# EAGLE board teensy_speeduino_5.1 (EAGLE 9.5.0), part 1 of 2
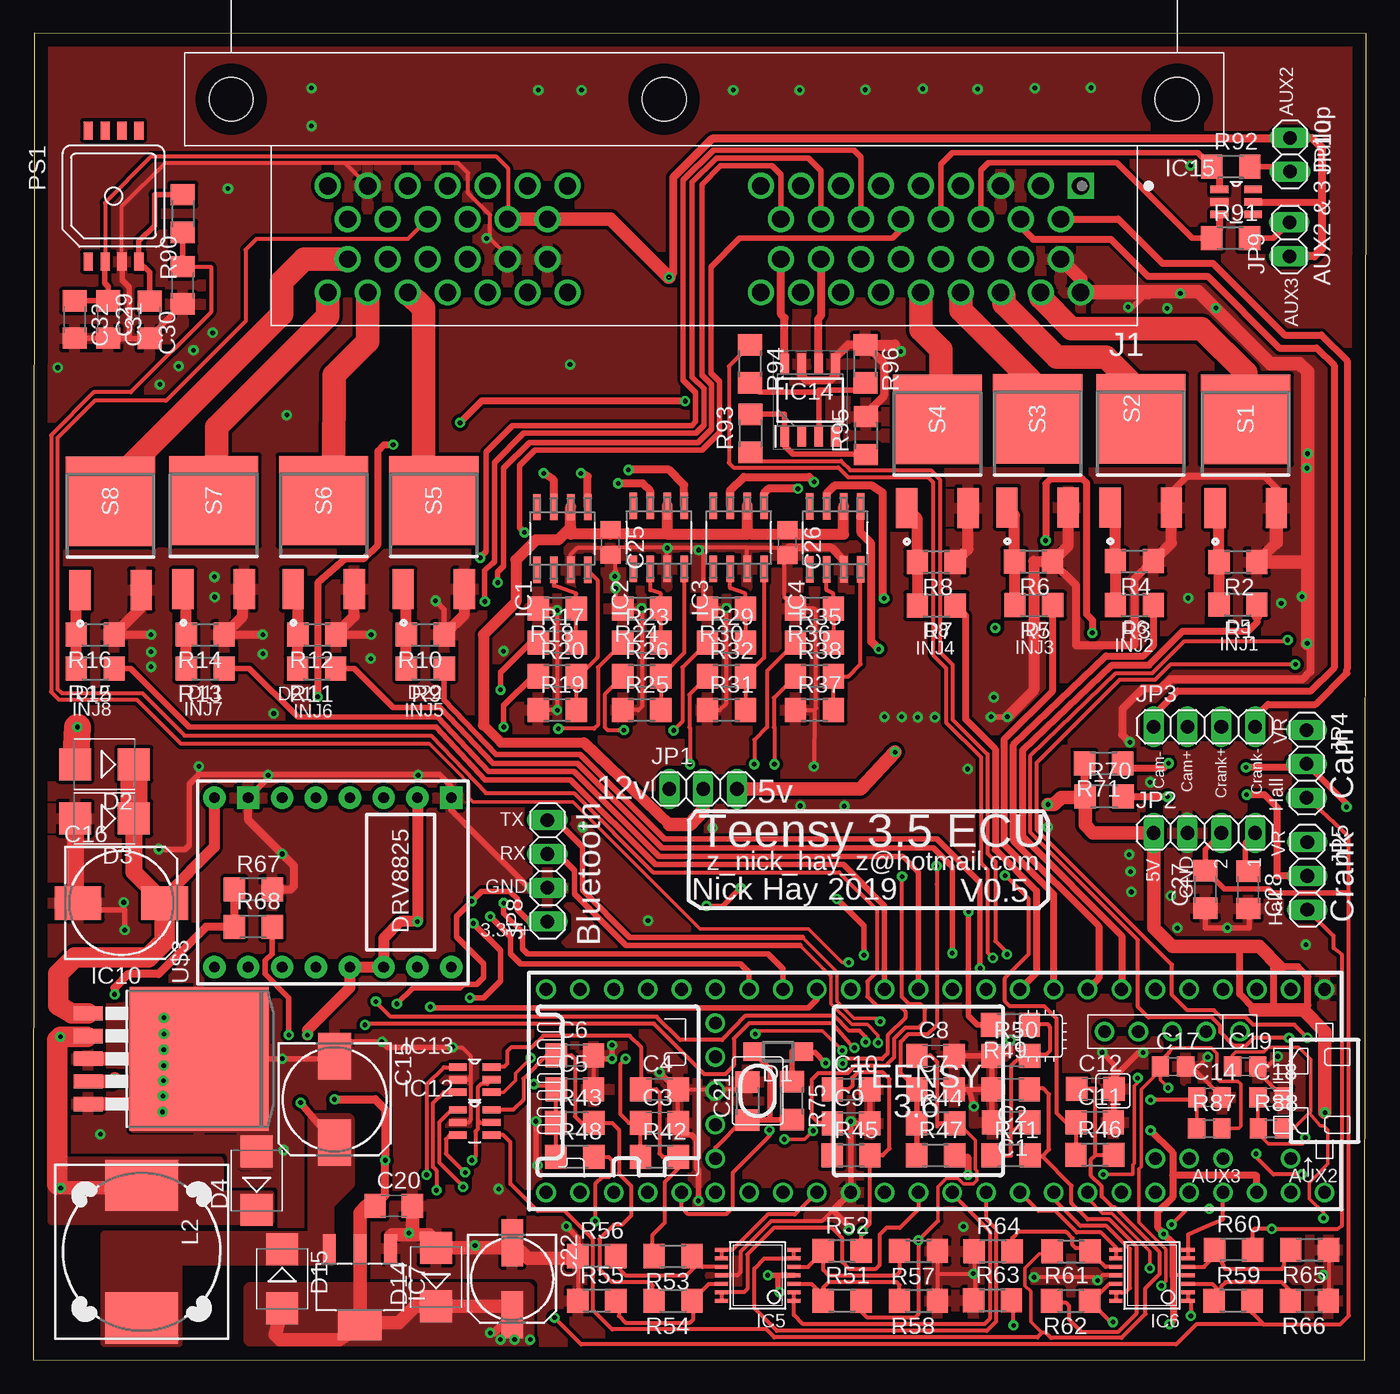
[diagram p2: board, top side]
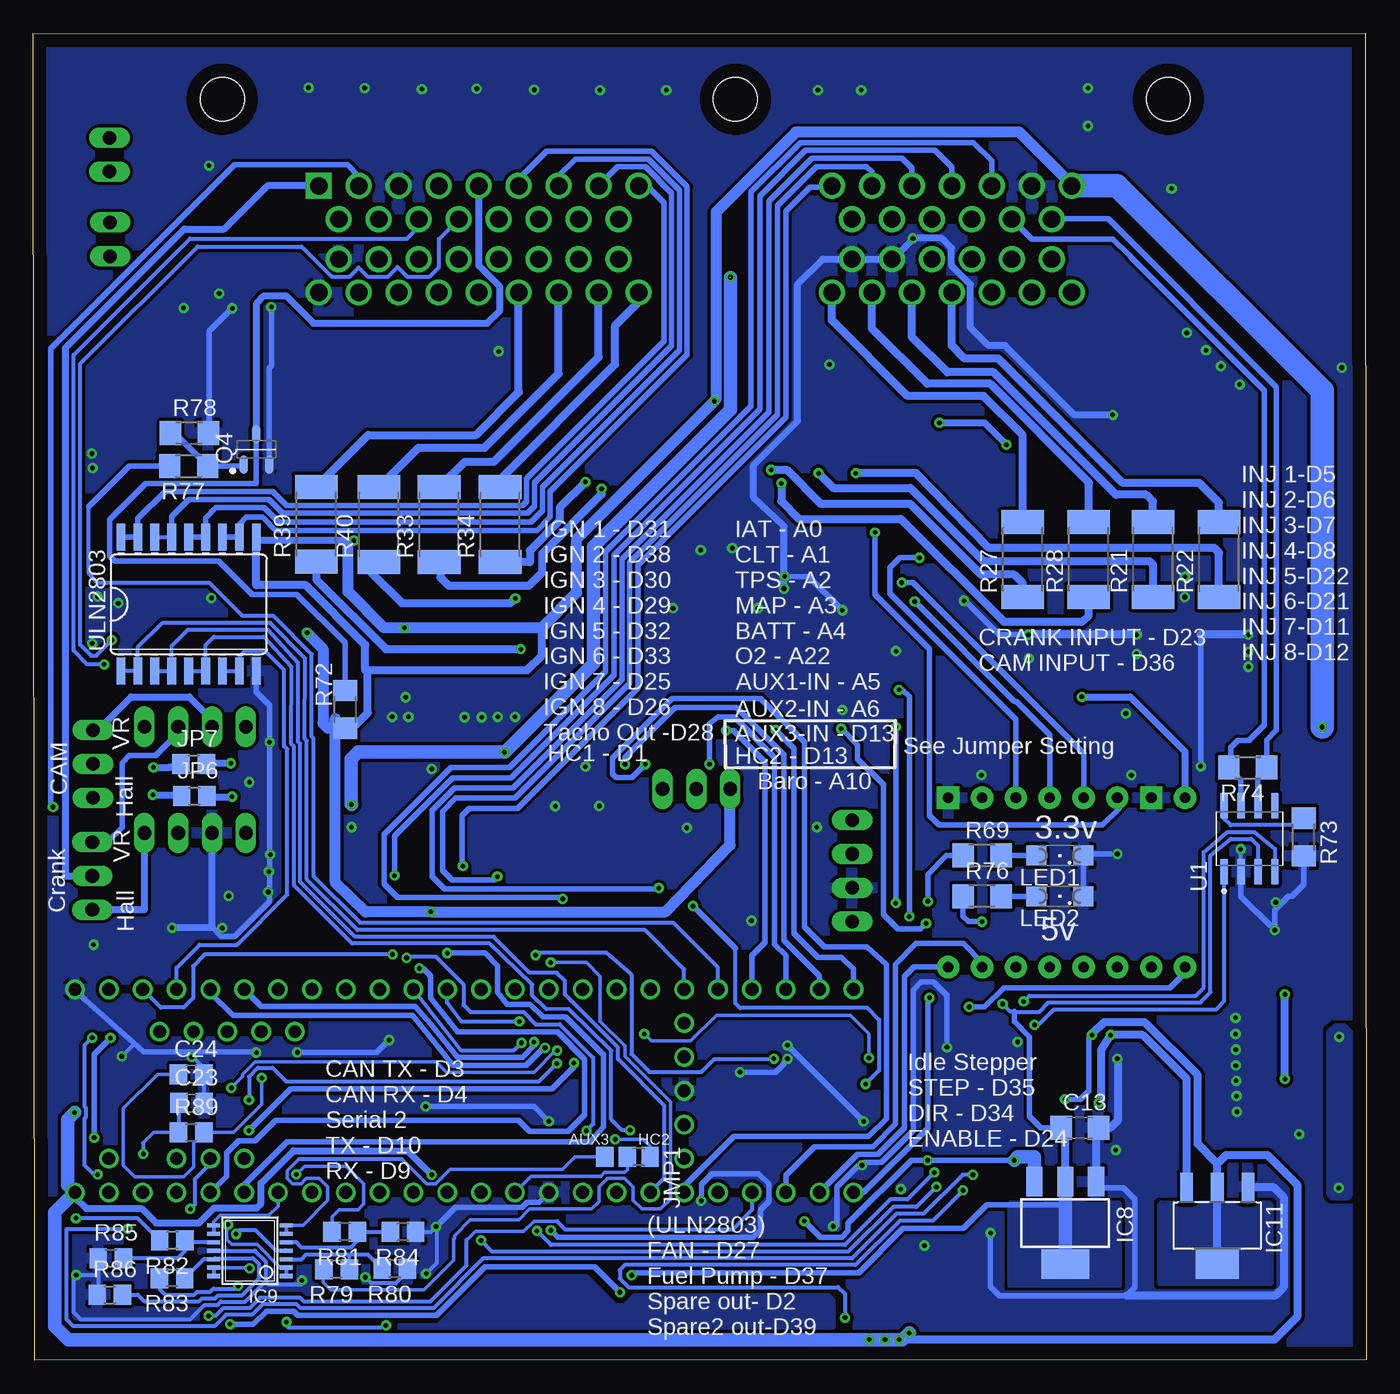
[diagram p3: board, bottom side, seen from below]

Size 100.03 x 99.58 mm. Coordinates in mm from the lower left corner, seen from the top.
Outline: 0,0.03 99.92,0 100.03,99.56 0.05,99.58 0,0.03
Copper layers (1*16): Top 0.035mm / dielectric 1.5mm / Bottom 0.035mm
Design rules "default *": minimum track width 6.5mil, minimum drill 0.35mm, track to track 7mil, track to pad 7mil, pad to pad 7mil, via to via 7mil, smd to smd 7mil, copper to edge 40mil, drill to drill 7mil, minimum pad ring 10mil, minimum via ring 8mil, stop-mask expansion 6mil, vias tented up to drill 0mil, thermal gap 10mil
Net classes: 0 default: width 0.254 mm, clearance 0.152 mm; 1 Power: width 0.508 mm, clearance 0.152 mm; 2 Output: width 1.27 mm, clearance 0.152 mm; 3 IGN: width 0.61 mm, clearance 0.152 mm; 4 5V+: width 0.305 mm, clearance 0.152 mm; 5 Relay: width 0.406 mm, clearance 0.152 mm; 6 GND: width 0.305 mm, clearance 0.152 mm

## Footprints (pad centres in the part's own frame; a part is rotated, then mirrored left to right if it is on the bottom)
C1206 = smd 1.6 x 1.8: 1 -1.4,0; 2 1.4,0
C0805 = smd 1.3 x 1.5: 1 -0.95,0; 2 0.95,0
153CLV-0810 = smd 3.5 x 2.5: + 3.25,0; - -3.25,0
R1206 = smd 1.6 x 1.803: 1 -1.422,0; 2 1.422,0
153CLV-0605 = smd 3.5 x 1.6: + 2.7,0; - -2.7,0
SOD123 = smd 1.4 x 1.4: A 1.9,0; C -1.9,0
SMB = smd 2.4 x 2.4: A 2.2,0; C -2.2,0
SOIC127P600X175-8N = smd 1.981 x 0.559: 1 -2.362,1.905; 2 -2.362,0.635; 3 -2.362,-0.635; 4 -2.362,-1.905; 5 2.362,-1.905; 6 2.362,-0.635; 7 2.362,0.635; 8 2.362,1.905
TSSOP14 = smd 0.305 x 0.991: 1 -1.905,-2.718; 2 -1.27,-2.718; 3 -0.635,-2.718; 4 0,-2.718; 5 0.635,-2.718; 6 1.27,-2.718; 7 1.905,-2.718; 8 1.905,2.718; 9 1.27,2.718; 10 0.635,2.718; 11 0,2.718; 12 -0.635,2.718; 13 -1.27,2.718; 14 -1.905,2.718
SOT223 = smd 0.95 x 2.15: 1 -2.3,-2.9; 2 0,-2.9; 3 2.3,-2.9 | smd 3.25 x 2.15: 4 0,2.9
SOT223' = smd 1.219 x 2.235: 1 -2.311,-3.099; 2 0,-3.099; 3 2.311,-3.099 | smd 3.6 x 2.2: TAB 0,3.099
TO263-5 = smd 1.067 x 2.159: 1 -3.404,-5.791; 2 -1.702,-5.791; 3 0,-5.791; 4 1.702,-5.791; 5 3.404,-5.791 | smd 10.8 x 10.41: 6 0,2.54
SOT95P280X145-6N = smd 1.321 x 0.559: 1 -1.27,0.94; 2 -1.27,0; 3 -1.27,-0.94; 4 1.27,-0.94; 5 1.27,0; 6 1.27,0.94
SOIC127P600X175-8N' = smd 1.525 x 0.65: 1 -2.712,1.905; 2 -2.712,0.635; 3 -2.712,-0.635; 4 -2.712,-1.905; 5 2.712,-1.905; 6 2.712,-0.635; 7 2.712,0.635; 8 2.712,1.905
TE_6437288-3 = drill 1.3 square: 1 -31.25,6.5 | drill 1.3: 2 -28.25,6.5; 3 -25.25,6.5; 4 -22.25,6.5; 5 -19.25,6.5; 6 -16.25,6.5; 7 -13.25,6.5; 8 -10.25,6.5; 9 -7.25,6.5; 10 -29.75,9; 11 -26.75,9; 12 -23.75,9; 13 -20.75,9; 14 -17.75,9; 15 -14.75,9; 16 -11.75,9; 17 -8.75,9; 18 -29.75,12; 19 -26.75,12; 20 -23.75,12; 21 -20.75,12; 22 -17.75,12; 23 -14.75,12; 24 -11.75,12; 25 -8.75,12; 26 -31.25,14.5; 27 -28.25,14.5; 28 -25.25,14.5; 29 -22.25,14.5; 30 -19.25,14.5; 31 -16.25,14.5; 32 -13.25,14.5; 33 -10.25,14.5; 34 -7.25,14.5; 35 7.25,6.5; 36 10.25,6.5; 37 13.25,6.5; 38 16.25,6.5; 39 19.25,6.5; 40 22.25,6.5; 41 25.25,6.5; 42 8.75,9; 43 11.75,9; 44 14.75,9; 45 17.75,9; 46 20.75,9; 47 23.75,9; 48 8.75,12; 49 11.75,12; 50 14.75,12; 51 17.75,12; 52 20.75,12; 53 23.75,12; 54 7.25,14.5; 55 10.25,14.5; 56 13.25,14.5; 57 16.25,14.5; 58 19.25,14.5; 59 22.25,14.5; 60 25.25,14.5 | hole 3.3: 0,0; -38.5,0; 32.5,0
A0R-JMP = smd 1.5 x 1.3: 1 0,1.7; 2 0,0; 3 0,-1.7
1X03 = drill 1.016 long: 1 -2.54,0; 2 0,0; 3 2.54,0
1X04 = drill 1.016 long: 1 -3.81,0; 2 -1.27,0; 3 1.27,0; 4 3.81,0
R0805 = smd 1.3 x 1.5: 1 -0.95,0; 2 0.95,0
1X02 = drill 1.016 long: 1 -1.27,0; 2 1.27,0
DR127 = smd 3.85 x 5.5: 1 -4.975,0; 2 4.975,0
SML1206 = smd 1.5 x 1.5: A 1.75,0; C -1.75,0
1317 = smd 1.346 x 0.686: 1 4.915,-1.905; 2 4.915,-0.635; 3 4.915,0.635; 4 4.915,1.905; 5 -4.915,1.905; 6 -4.915,0.635; 7 -4.915,-0.635; 8 -4.915,-1.905
SOT95P280X135-3N = smd 1.4 x 0.65: 1 -1.15,0.95; 2 -1.15,-0.95; 3 1.15,0
R2512 = smd 1.8 x 3.2: 1 -2.8,0; 2 2.8,0
TO-252-(DPAK)_1 = smd 3 x 1.6: 1 8.65,-2.3; 2 8.65,2.3 | smd 6.7 x 6.7: 3 2,0
SOIC127P600X175-8N'' = smd 1.97 x 0.6: 1 -2.475,1.905; 2 -2.475,0.635; 3 -2.475,-0.635; 4 -2.475,-1.905; 5 2.475,-1.905; 6 2.475,-0.635; 7 2.475,0.635; 8 2.475,1.905
TEENSY_3.5/3.6 = drill 0.965: 0/RX -25.4,-7.62; 1/TX -22.86,-7.62; 2 -20.32,-7.62; 3/CANTX -17.78,-7.62; 3V3 7.62,-7.62; 3V3_2 17.78,-2.54; 3V3_LO -22.86,7.62; 4/CANRX -15.24,-7.62; 5 -12.7,-7.62; 6 -10.16,-7.62; 7 -7.62,-7.62; 8 -5.08,-7.62; 9/CS -2.54,-7.62; 10/CS 0,-7.62; 11/MOSI 2.54,-7.62; 12/MISO 5.08,-7.62; 13/SCK 5.08,7.62; 14/A0 2.54,7.62; 15/A1 0,7.62; 16/A2 -2.54,7.62; 17/A3 -5.08,7.62; 18/A4/SDA -7.62,7.62; 19/A5/SCL -10.16,7.62; 20/A6 -12.7,7.62; 21/A7 -15.24,7.62; 21/DAC0 12.7,7.62; 22/A8 -17.78,7.62; 23/A9 -20.32,7.62; 24 10.16,-7.62; 25 12.7,-7.62; 26 15.24,-7.62; 27 17.78,-7.62; 28 20.32,-7.62; 29 22.86,-7.62; 30 25.4,-7.62; 31/A12 27.94,-7.62; 32/A13 30.48,-7.62; 33/A14 30.48,7.62; 34/A15 27.94,7.62; 35/A16 25.4,7.62; 36/A17 22.86,7.62; 37/A18 20.32,7.62; 38/A19 17.78,7.62; 39/A20 15.24,7.62; A10 -17.78,5.08; A11 -15.24,5.08; A22/DAC1 10.16,7.62; AGND -25.4,7.62; AREF -20.32,5.08; GND -27.94,-7.62; GND2 7.62,7.62; GND3 17.78,0; PROG 17.78,2.54; RESET 17.78,5.08; U5V -21.59,-4.445; UD+ -16.51,-4.445; UD- -19.05,-4.445; UGND1 -13.97,-4.445; UGND2 -11.43,-4.445; VBAT 17.78,-5.08; VIN -27.94,7.62; VUSB -25.4,5.08
POLOLU-DRV8825 = drill 0.8 pad 1.676: A1 6.35,-1.27; A2 6.35,-3.81; B1 6.35,1.27; B2 6.35,3.81; DIR -6.35,-8.89; EN_N -6.35,8.89; FLT_N 6.35,-6.35; M0 -6.35,6.35; M1 -6.35,3.81; M2 -6.35,1.27; RST_N -6.35,-1.27; SLP_N -6.35,-3.81; STEP_N -6.35,-6.35; VMOT 6.35,8.89 | drill 0.8 pad 1.676 square: GND 6.35,-8.89; GND2 6.35,6.35
SO18W = smd 0.66 x 2.032: 1 -5.08,-5.029; 2 -3.81,-5.029; 3 -2.54,-5.029; 4 -1.27,-5.029; 5 0,-5.029; 6 1.27,-5.029; 7 2.54,-5.029; 8 3.81,-5.029; 9 5.08,-5.029; 10 5.08,5.029; 11 3.81,5.029; 12 2.54,5.029; 13 1.27,5.029; 14 0,5.029; 15 -1.27,5.029; 16 -2.54,5.029; 17 -3.81,5.029; 18 -5.08,5.029

## Placement (x,y rotation side)
C1  .1uf  [C1206]  73.38,17.86 180 top
C2  .22uf  [C1206]  73.36,20.35 180 top
C3  .1uf  [C1206]  46.99,17.81 0 top
C4  .22uf  [C1206]  46.99,20.35 0 top
C5  .1uf  [C1206]  40.64,20.35 0 top
C6  .22uf  [C1206]  40.64,22.89 0 top
C7  .1uf  [C1206]  67.72,20.32 0 top
C8  .22uf  [C1206]  67.72,22.86 0 top
C9  .1uf  [C1206]  61.37,17.78 0 top
C10  .22uf  [C1206]  61.37,20.32 0 top
C11  .1uf  [C1206]  79.65,17.86 0 top
C12  .22uf  [C1206]  79.71,20.37 0 top
C13  100nf  [C1206]  21.49,17.45 0 bottom
C14  .1uf  [C0805]  88.27,19.74 0 top
C15  820uf  [153CLV-0810]  22.61,19.58 270 top
C16  470uf  [153CLV-0810]  6.6,34.32 0 top
C17  .22uf  [C0805]  85.52,22.05 0 top
C18  .1uf  [C0805]  92.85,19.74 0 top
C19  .22uf  [C0805]  90.95,22.05 0 top
C20  100nf  [C1206]  27.05,11.58 0 top
C21  4.7nF  [R1206]  53.59,19.46 90 top
C22  220  [153CLV-0605]  35.94,6.12 270 top
C23  .1uf  [C0805]  88.15,19.3 0 bottom
C24  .22uf  [C0805]  88.18,21.46 0 bottom
C25  .1uf  [C0805]  43.31,61.39 270 top
C26  .1uf  [C0805]  56.59,61.37 270 top
C27  0.01uf  [C1206]  87.96,35.33 90 top
C28  0.01uf  [C1206]  91.16,35.31 270 top
C29  .1uf  [C1206]  8.74,78.08 90 top
C30  .22uf  [C1206]  11.23,80.67 90 top
C31  .1uf  [C1206]  5.61,78.11 270 top
C32  .1uf  [C1206]  3.1,78.11 270 top
D1  1N5819HW-7-F  [SOD123]  55.91,23.16 180 top
D2  1n5819  [SMB]  5.33,44.73 180 top
D3  18v Zener  [SMB]  5.33,40.67 180 top
D4  1n5819  [SMB]  16.76,13.49 90 top
D14  5V Zener  [SMB]  30.23,6.25 90 top
D15  5819  [SMB]  18.67,6.12 270 top
IC1  TC4424AVOA  [SOIC127P600X175-8N]  39.7,61.67 90 top
IC2  TC4424AVOA  [SOIC127P600X175-8N]  46.94,61.75 90 top
IC3  TC4424AVOA  [SOIC127P600X175-8N]  52.93,61.75 90 top
IC4  TC4424AVOA  [SOIC127P600X175-8N]  60.17,61.72 90 top
IC5  LMV324MZ  [TSSOP14]  54.36,6.38 90 top
IC6  LMV324MZ  [TSSOP14]  83.95,6.38 90 top
IC7  LM1117MP-5.0  [SOT223]  24.51,5.49 180 top
IC8  LM1117MPX-3.3  [SOT223']  22.58,10.31 180 bottom
IC9  LMV324MZ  [TSSOP14]  83.77,8.23 90 bottom
IC10  [TO263-5]  9.91,22.63 270 top
IC11  LM1117MP-5.0  [SOT223]  11.18,10.11 180 bottom
IC12  SP724AHTG  [SOT95P280X145-6N]  33.12,17.86 0 top
IC13  SP724AHTG  [SOT95P280X145-6N]  33.12,21.06 0 top
IC14  VNLD5090-E  [SOIC127P600X175-8N']  58.29,72.06 90 top
IC15  SP724AHTG  [SOT95P280X145-6N]  90.27,86.92 0 top
J1  6437288-3  [TE_6437288-3]  47.35,94.64 180 top
JMP1  0R-JUMPA  [A0R-JMP]  55.45,15.27 270 bottom
JP1  Output Select  [1X03]  50.27,42.88 0 top
JP2  vrl  [1X04]  87.88,39.57 0 top
JP3  vrr  [1X04]  87.88,47.55 0 top
JP4  Input select vr2  [1X03]  95.55,44.75 270 top
JP5  input select vr1  [1X03]  95.61,36.35 270 top
JP6  0  [R0805]  87.93,42.34 0 bottom
JP7  0  [R0805]  87.99,44.75 0 bottom
JP8  [1X04]  38.58,36.73 90 top
JP9  [1X02]  94.26,84.12 90 top
JP10  [1X02]  94.31,90.47 270 top
L2  DR127  [DR127]  8.13,8.15 270 top
LED1  [SML1206]  22.99,37.87 180 bottom
LED2  [SML1206]  22.99,34.82 180 bottom
PS1  MPXH6400A6T1  [1317]  6.02,87.38 270 top
Q4  IRLML0030TRPBF  [SOT95P280X135-3N]  83.29,68.35 90 bottom
R1  1k  [R1206]  90.4,56.72 180 top
R2  100k  [R1206]  90.4,59.92 180 top
R3  1k  [R1206]  82.63,56.67 180 top
R4  100k  [R1206]  82.63,59.97 180 top
R5  1k  [R1206]  75.08,56.67 180 top
R6  100k  [R1206]  75.06,59.94 180 top
R7  1k  [R1206]  67.77,56.64 180 top
R8  100k  [R1206]  67.77,59.92 180 top
R9  1k  [R1206]  29.41,51.92 180 top
R10  100k  [R1206]  29.41,54.46 180 top
R11  1k  [R1206]  21.26,51.92 180 top
R12  100k  [R1206]  21.29,54.46 180 top
R13  1k  [R1206]  12.9,51.92 180 top
R14  100k  [R1206]  12.9,54.46 180 top
R15  1k  [R1206]  4.65,51.92 180 top
R16  100k  [R1206]  4.65,54.46 180 top
R17  1k  [R1206]  39.32,53.87 0 top
R18  100k  [R1206]  39.32,56.41 180 top
R19  100k  [R1206]  39.32,48.79 0 top
R20  1k  [R1206]  39.32,51.33 0 top
R21  15r 2w  [R2512]  16,60.1 90 bottom
R22  15r 2w  [R2512]  11.05,60.1 90 bottom
R23  1k  [R1206]  45.67,53.87 0 top
R24  100k  [R1206]  45.67,56.41 180 top
R25  100k  [R1206]  45.67,48.79 0 top
R26  1k  [R1206]  45.67,51.33 0 top
R27  15r 2w  [R2512]  25.78,60.1 90 bottom
R28  15r 2w  [R2512]  20.83,60.1 90 bottom
R29  1k  [R1206]  52.02,53.87 0 top
R30  100k  [R1206]  52.02,56.41 180 top
R31  100k  [R1206]  52.02,48.79 0 top
R32  1k  [R1206]  52.02,51.33 0 top
R33  15r 2w  [R2512]  69.57,62.71 90 bottom
R34  15r 2w  [R2512]  65,62.71 90 bottom
R35  1k  [R1206]  58.62,53.87 0 top
R36  100k  [R1206]  58.62,56.41 180 top
R37  100k  [R1206]  58.62,48.79 0 top
R38  1k  [R1206]  58.62,51.33 0 top
R39  15r 2w  [R2512]  78.79,62.74 90 bottom
R40  15r 2w  [R2512]  74.09,62.71 90 bottom
R41  470  [R1206]  73.38,15.37 0 top
R42  470  [R1206]  46.99,15.27 0 top
R43  470  [R1206]  40.64,17.81 0 top
R44  470  [R1206]  67.72,17.78 0 top
R45  470  [R1206]  61.37,15.37 0 top
R46  470  [R1206]  79.65,15.42 0 top
R47  2.49k  [R1206]  67.72,15.37 0 top
R48  2.49k  [R1206]  40.64,15.27 0 top
R49  3.9k  [R1206]  73.33,25.17 180 top
R50  1k  [R1206]  73.36,22.86 0 top
R51  180k  [R1206]  60.71,4.47 0 top
R52  180k  [R1206]  60.71,8.2 0 top
R53  180k  [R1206]  48.01,7.82 180 top
R54  180k  [R1206]  48.01,4.47 180 top
R55  330k  [R1206]  42.29,4.47 0 top
R56  330k  [R1206]  42.29,7.82 0 top
R57  330k  [R1206]  66.42,8.2 180 top
R58  330k  [R1206]  66.42,4.47 180 top
R59  180k  [R1206]  90.04,4.47 0 top
R60  180k  [R1206]  90.07,8.31 0 top
R61  180k  [R1206]  77.88,8.18 180 top
R62  180k  [R1206]  77.85,4.47 180 top
R63  330k  [R1206]  71.98,4.5 0 top
R64  330k  [R1206]  72.03,8.18 0 top
R65  330k  [R1206]  95.78,8.31 180 top
R66  330k  [R1206]  95.76,4.47 180 top
R67  1k  [R1206]  16.51,35.33 0 top
R68  4.7k  [R1206]  16.51,32.54 0 top
R69  2.4k  [R1206]  28.83,37.87 0 bottom
R70  10k  [R1206]  80.37,42.32 0 top
R71  10k  [R1206]  80.31,44.81 180 top
R72  10k  [R1206]  76.63,48.84 90 bottom
R73  10K  [R1206]  4.7,39.27 270 bottom
R74  120R  [R1206]  8.89,44.48 180 bottom
R75  10K  [R1206]  56.92,19.48 270 top
R76  2.4k  [R1206]  28.83,34.82 0 bottom
R77  1k  [R1206]  88.37,67.11 180 bottom
R78  100k  [R1206]  88.32,69.57 0 bottom
R79  180k  [R0805]  77.27,6.83 180 bottom
R80  330k  [R0805]  72.9,6.86 180 bottom
R81  180k  [R0805]  76.66,9.65 180 bottom
R82  180k  [R0805]  89.59,8.99 180 bottom
R83  180k  [R0805]  89.61,6.17 180 bottom
R84  330k  [R0805]  72.29,9.63 180 bottom
R85  330k  [R0805]  94.21,7.67 0 bottom
R86  330k  [R0805]  94.28,4.93 0 bottom
R87  470  [R0805]  88.24,17.4 0 top
R88  470  [R0805]  92.88,17.4 0 top
R89  470  [R0805]  88.18,17.09 0 bottom
R90  470  [R1206]  11.23,86.06 90 top
R91  10k  [R1206]  89.84,84.2 0 top
R92  2.49k  [R1206]  89.87,89.56 0 top
R93  1k  [R1206]  53.82,69.57 90 top
R94  1k  [R1206]  53.8,74.78 270 top
R95  100k  [R1206]  62.48,69.39 90 top
R96  100k  [R1206]  62.43,74.78 270 top
S1  VND5N07-E  [TO-252-(DPAK)_1]  90.98,72.62 270 top
S2  VND5N07-E  [TO-252-(DPAK)_1]  83.11,72.64 270 top
S3  VND5N07-E  [TO-252-(DPAK)_1]  75.36,72.64 270 top
S4  VND5N07-E  [TO-252-(DPAK)_1]  67.84,72.62 270 top
S5  VND5N07-E  [TO-252-(DPAK)_1]  30.05,66.52 270 top
S6  VND5N07-E  [TO-252-(DPAK)_1]  21.79,66.52 270 top
S7  VND5N07-E  [TO-252-(DPAK)_1]  13.54,66.52 270 top
S8  VND5N07-E  [TO-252-(DPAK)_1]  5.79,66.47 270 top
U1  SN65HVD230QDR  [SOIC127P600X175-8N'']  8.76,39.14 90 bottom
U$1  TEENSY_3.5/3.6  [TEENSY_3.5/3.6]  68.96,20.22 180 top
U$3  POLOLU-DRV8825  [POLOLU-DRV8825]  22.48,35.86 90 top
ULN2803  uln2803  [SO18W]  88.37,56.74 0 bottom